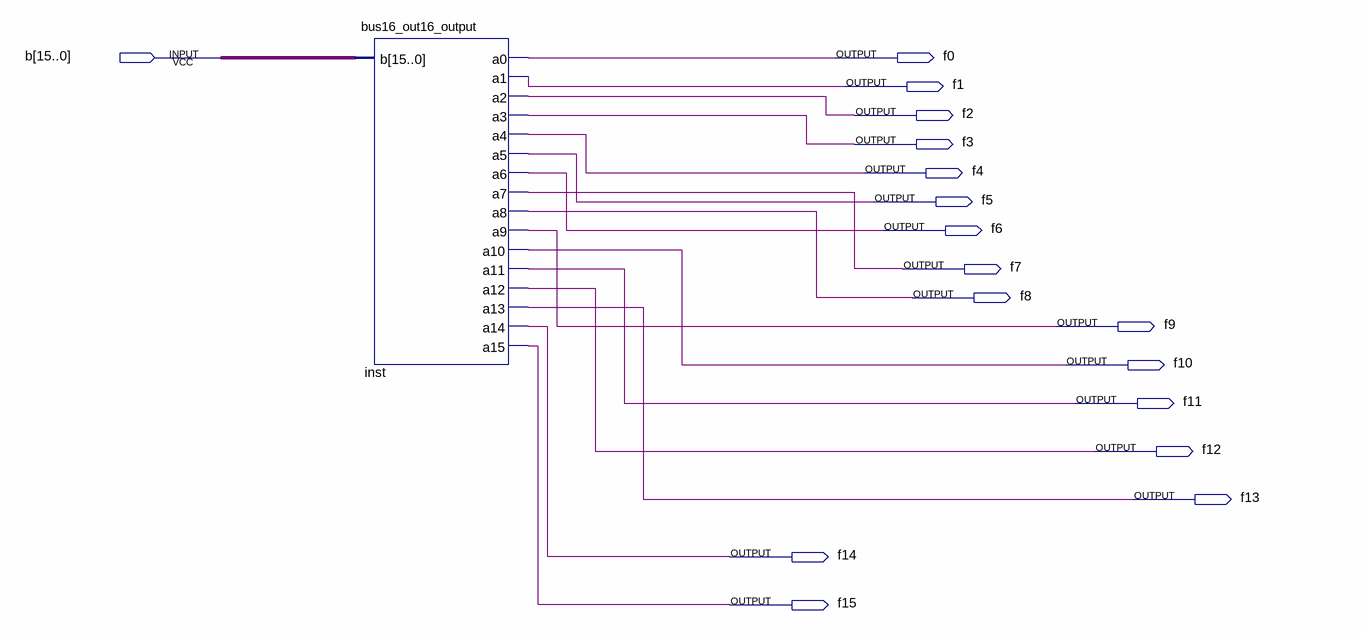
[diagram p0: schematic sheet]
// Quartus schematic bus16_out16_output_2.bdf as structural Verilog: 1 symbols, 17 pins
module bus16_out16_output_2 (
  input  [15:0] b,
  output f0,
  output f1,
  output f2,
  output f3,
  output f4,
  output f5,
  output f6,
  output f7,
  output f8,
  output f9,
  output f10,
  output f11,
  output f12,
  output f13,
  output f14,
  output f15
);

  bus16_out16_output inst (
    .b(b), .a0(f0), .a1(f1), .a2(f2), .a3(f3), .a4(f4), .a5(f5), .a6(f6), .a7(f7), .a8(f8), .a9(f9),
    .a10(f10), .a11(f11), .a12(f12), .a13(f13), .a14(f14), .a15(f15));
endmodule
